# EAGLE schematic Charger Board (EAGLE 6.2)
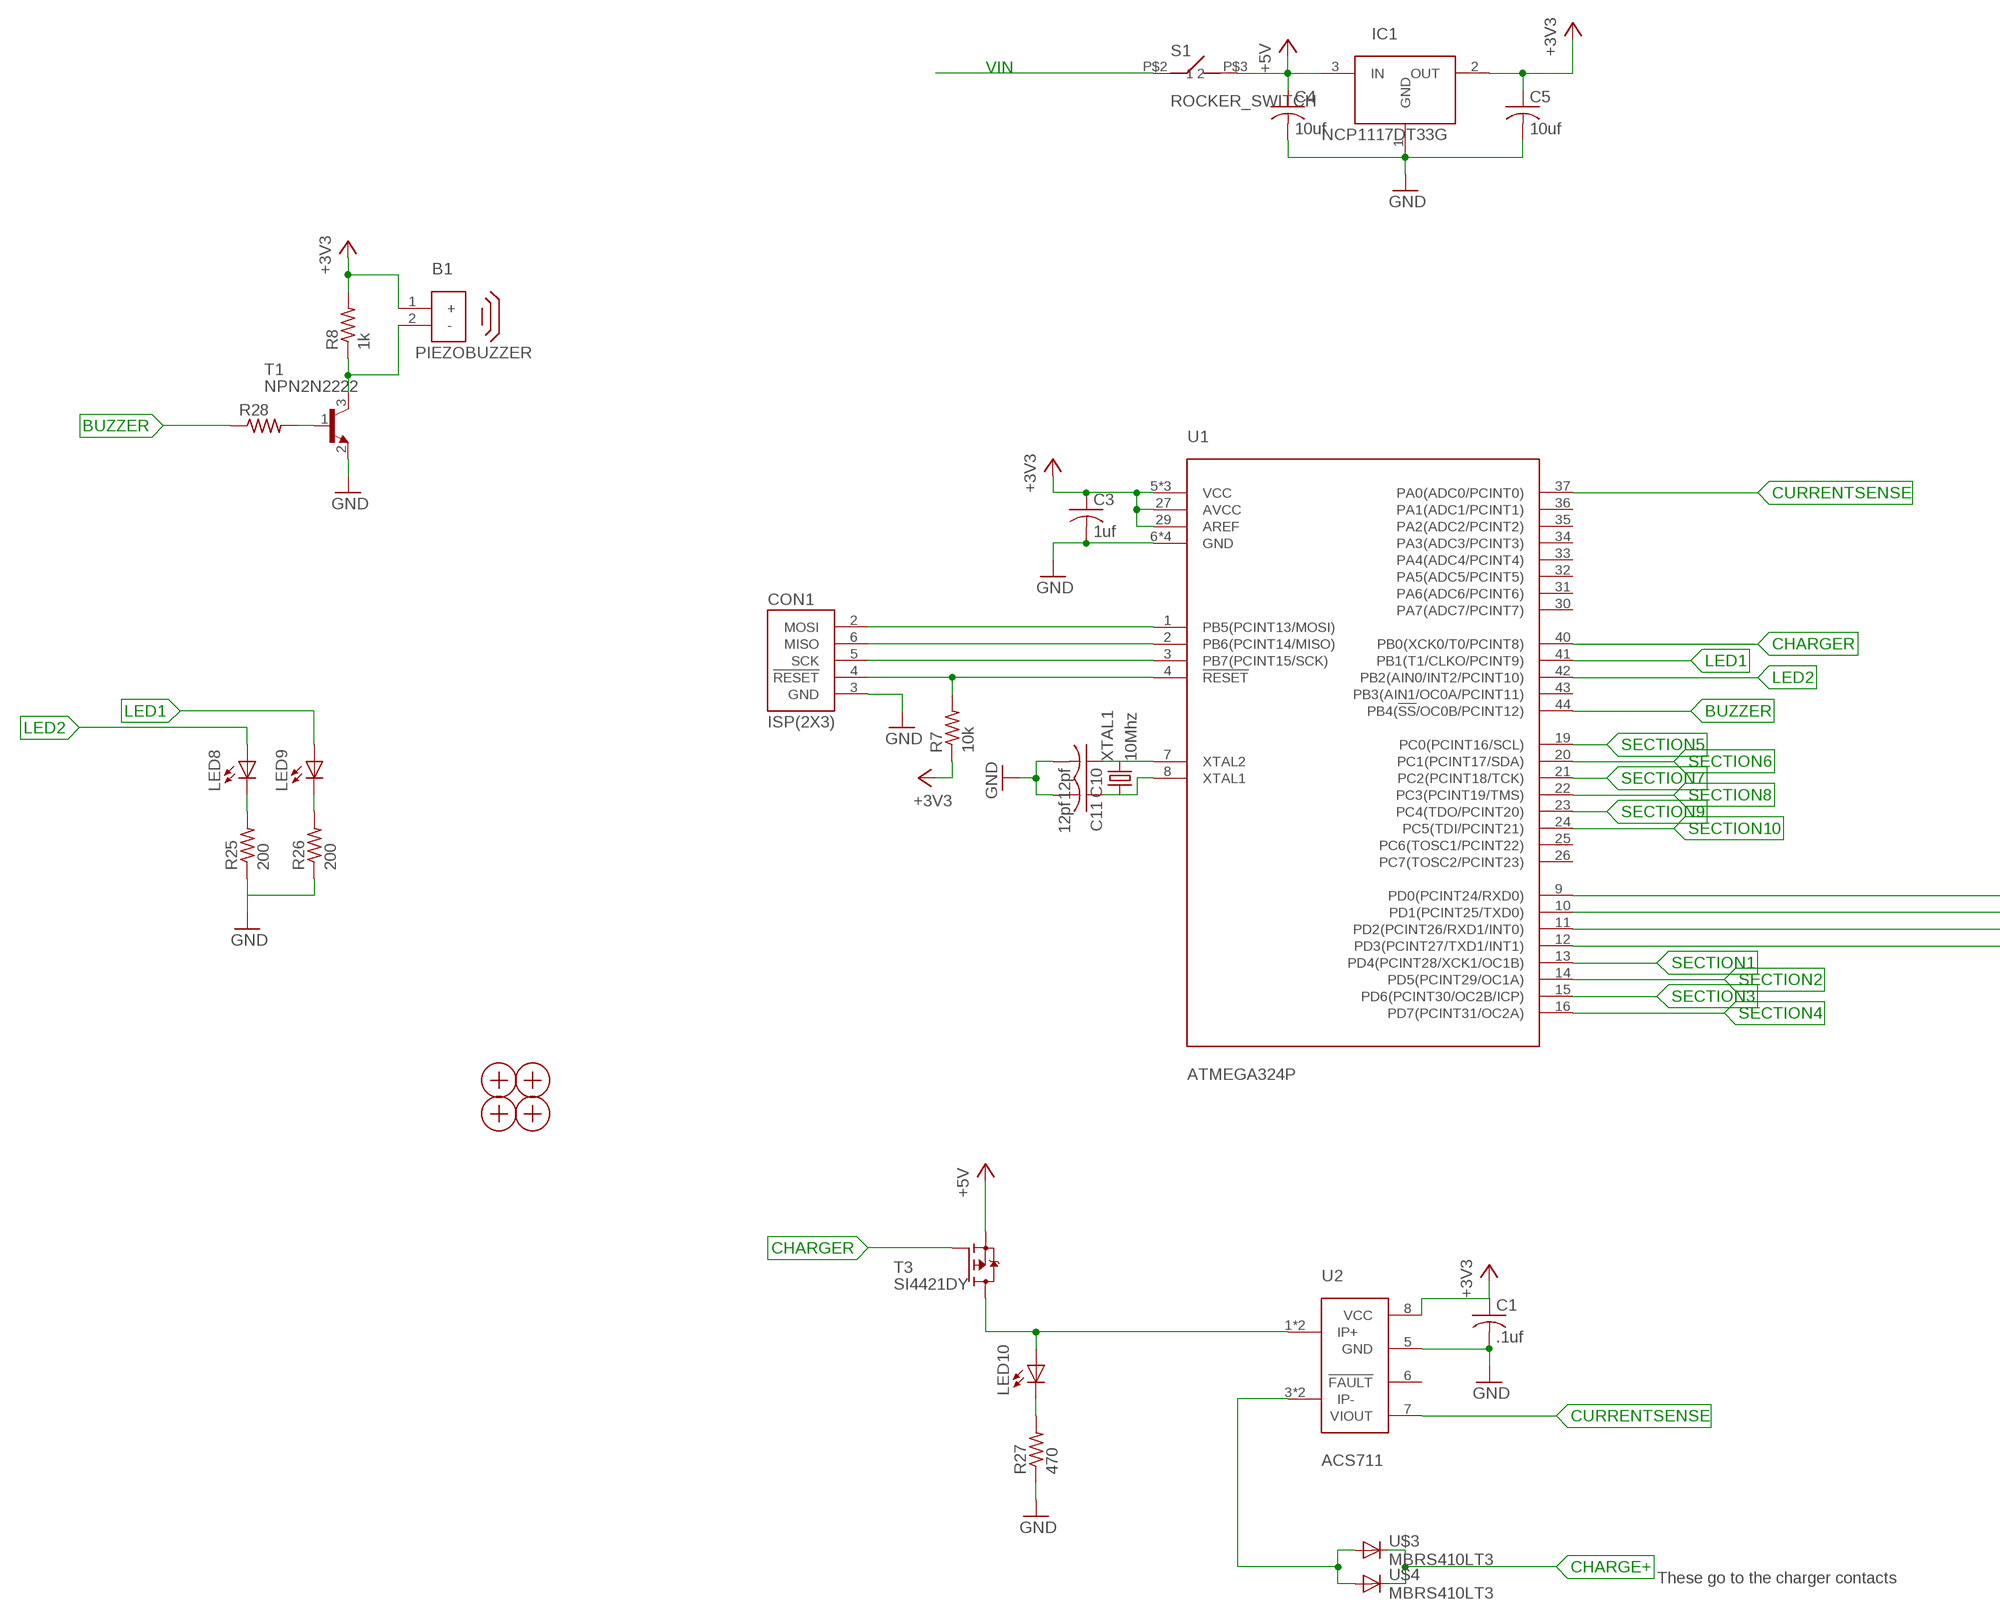
[diagram p0: schematic, sheet 1, part 1 of 2]
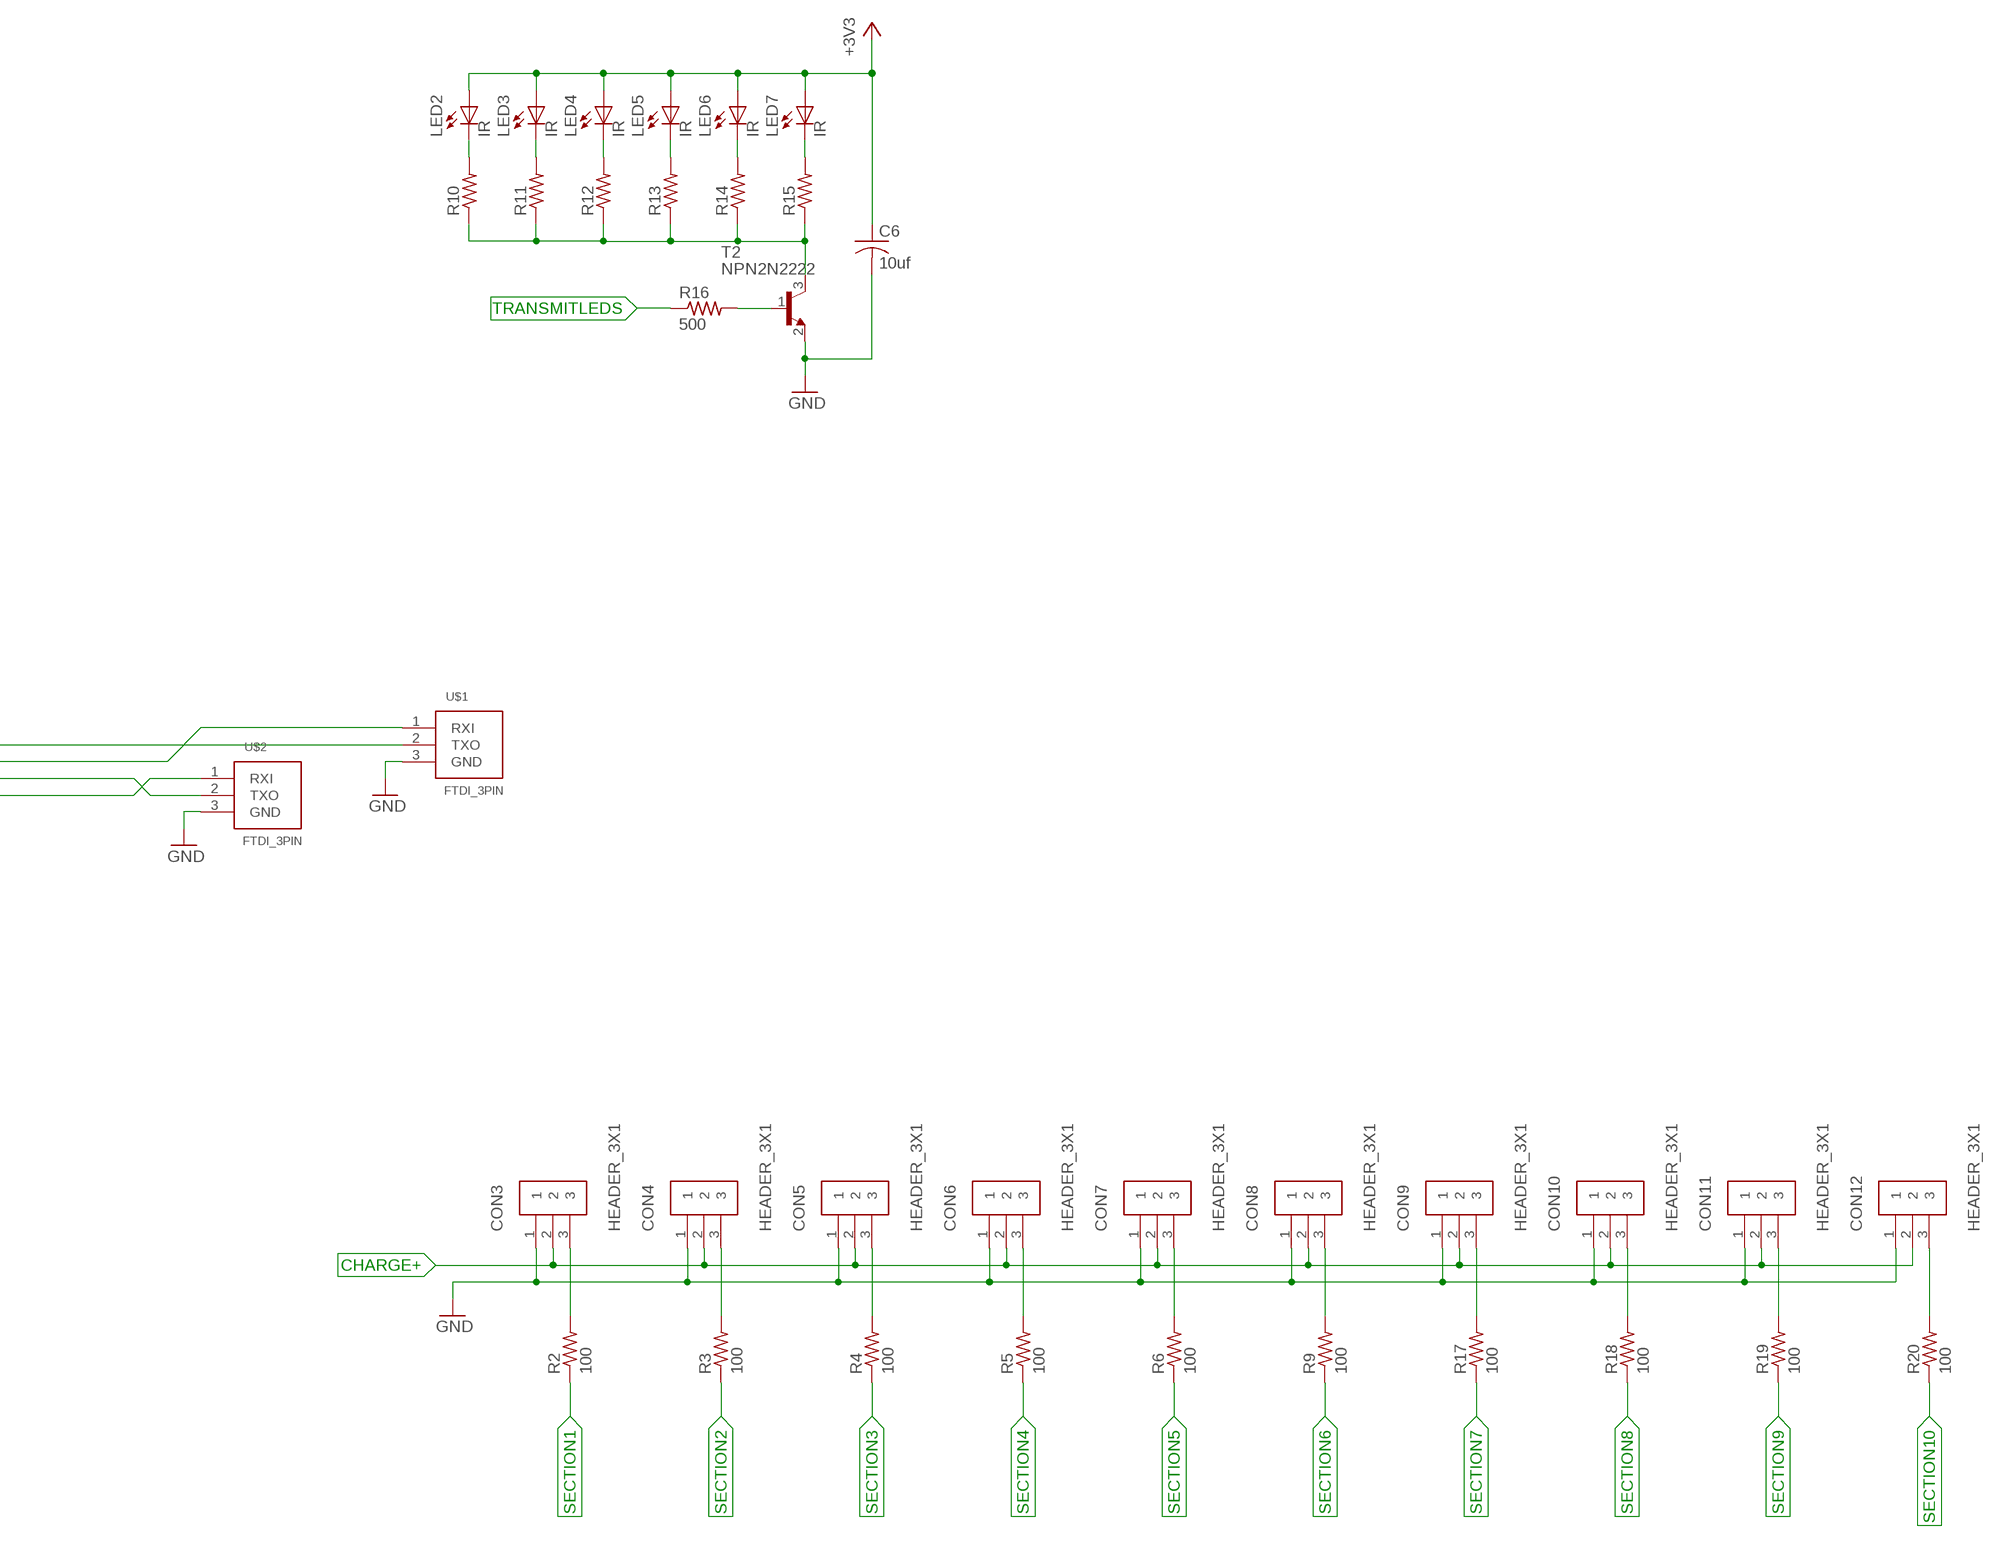
[diagram p1: schematic, sheet 1, part 2 of 2]

## Parts
B1  PIEZOBUZZER  [PIEZOBUZZER]
C1  .1uf  CAP0603  [0603]
C3  1uf  CAP0603  [0603]
C4  10uf  CAP0805  [0805]
C5  10uf  CAP0805  [0805]
C6  10uf  CAP0805  [0805]
C10  12pf  CAP0603  [0603]
C11  12pf  CAP0603  [0603]
CON1  ISP(2X3)  [PINHEADER(2X3)]
CON3  HEADER_3X1  [3PINHEADER_.100"]
CON4  HEADER_3X1  [3PINHEADER_.100"]
CON5  HEADER_3X1  [3PINHEADER_.100"]
CON6  HEADER_3X1  [3PINHEADER_.100"]
CON7  HEADER_3X1  [3PINHEADER_.100"]
CON8  HEADER_3X1  [3PINHEADER_.100"]
CON9  HEADER_3X1  [3PINHEADER_.100"]
CON10  HEADER_3X1  [3PINHEADER_.100"]
CON11  HEADER_3X1  [3PINHEADER_.100"]
CON12  HEADER_3X1  [3PINHEADER_.100"]
H1  MOUNTINGHOLE  [MOUNTINGHOLE]
H2  MOUNTINGHOLE  [MOUNTINGHOLE]
H3  MOUNTINGHOLE  [MOUNTINGHOLE]
H4  MOUNTINGHOLE  [MOUNTINGHOLE]
IC1  NCP1117DT33G  [DPAK]
LED2  IR  LED5MMRA  [5MM_LED_RA]
LED3  IR  LED5MMRA  [5MM_LED_RA]
LED4  IR  LED5MMRA  [5MM_LED_RA]
LED5  IR  LED5MMRA  [5MM_LED_RA]
LED6  IR  LED5MMRA  [5MM_LED_RA]
LED7  IR  LED5MMRA  [5MM_LED_RA]
LED8  LED0603  [0603]
LED9  LED0603  [0603]
LED10  LED0603  [0603]
R2  100  RES0603  [0603]
R3  100  RES0603  [0603]
R4  100  RES0603  [0603]
R5  100  RES0603  [0603]
R6  100  RES0603  [0603]
R7  10k  RES0603  [0603]
R8  1k  RES0603  [0603]
R9  100  RES0603  [0603]
R10  RES0603  [0603]
R11  RES0603  [0603]
R12  RES0603  [0603]
R13  RES0603  [0603]
R14  RES0603  [0603]
R15  RES0603  [0603]
R16  500  RES0603  [0603]
R17  100  RES0603  [0603]
R18  100  RES0603  [0603]
R19  100  RES0603  [0603]
R20  100  RES0603  [0603]
R25  200  RES0603  [0603]
R26  200  RES0603  [0603]
R27  470  RES0603  [0603]
R28  RES0603  [0603]
S1  ROCKER_SWITCH  [DUMMY]
T1  NPN2N2222  [SOT23]
T2  NPN2N2222  [SOT23]
T3  SI4421DY  [S0-8]
U1  ATMEGA324P  [TQFP44]
U2  ACS711  [8SOIC]
U$1  FTDI_3PIN  [3PINHEADER_.100"]
U$2  FTDI_3PIN  [3PINHEADER_.100"]
U$3  MBRS410LT3  [SMD_DIODE]
U$4  MBRS410LT3  [SMD_DIODE]
XTAL1  10Mhz  NX5032GA-10.000000MHZ  [SMDXTAL]

## Nets
+3V3: B1.1(+) C1.1 C3.1 C5.1 C6.1 IC1.2(OUT) LED2.1(A) LED3.1(A) LED4.1(A) LED5.1(A) LED6.1(A) LED7.1(A) R7.1 R8.2 U1.5(VCC) U1.17(VCC) U1.27(AVCC) U1.29(AREF) U1.38(VCC) U2.8(VCC)
+5V: C4.1 IC1.3(IN) S1.P$3 T3.1(S) T3.2(S) T3.3(S)
BUZZER: R28.1 U1.44(PB4(!SS!/OC0B/PCINT12))
CHARGE+: CON3.2 CON4.2 CON5.2 CON6.2 CON7.2 CON8.2 CON9.2 CON10.2 CON11.2 CON12.2 U$3.2(C) U$4.2(C)
CHARGER: T3.4(G) U1.40(PB0(XCK0/T0/PCINT8))
CURRENTSENSE: U1.37(PA0(ADC0/PCINT0)) U2.7(VIOUT)
GND: C1.2 C3.2 C4.2 C5.2 C6.2 C10.2 C11.2 CON1.3(GND) CON3.1 CON4.1 CON5.1 CON6.1 CON7.1 CON8.1 CON9.1 CON10.1 CON11.1 CON12.1 IC1.1(GND) R25.1 R26.1 R27.1 T1.2(E) T2.2(E) U1.6(GND) U1.18(GND) U1.28(GND) U1.39(GND) U2.5(GND) U$1.3(GND) U$2.3(GND)
LED1: LED9.2(A) U1.41(PB1(T1/CLKO/PCINT9))
LED2: LED8.2(A) U1.42(PB2(AIN0/INT2/PCINT10))
N$1: LED10.2(A) T3.5(D) T3.6(D) T3.7(D) T3.8(D) U2.1(IP+) U2.2(IP+)
N$2: CON1.2(MOSI) U1.1(PB5(PCINT13/MOSI))
N$3: CON1.6(MISO) U1.2(PB6(PCINT14/MISO))
N$4: U1.11(PD2(PCINT26/RXD1/INT0)) U$2.2(TXO)
N$5: CON1.5(SCK) U1.3(PB7(PCINT15/SCK))
N$6: CON1.4(!RESET) R7.2 U1.4(!RESET)
N$7: U1.10(PD1(PCINT25/TXD0)) U$1.1(RXI)
N$8: U1.9(PD0(PCINT24/RXD0)) U$1.2(TXO)
N$9: B1.2(-) R8.1 T1.3(C)
N$10: R10.1 R11.1 R12.1 R13.1 R14.1 R15.1 T2.3(C)
N$11: R16.2 T2.1(B)
N$12: C10.1 U1.7(XTAL2) XTAL1.2
N$13: LED2.2(C) R10.2
N$14: LED3.2(C) R11.2
N$15: LED4.2(C) R12.2
N$16: LED5.2(C) R13.2
N$17: LED6.2(C) R14.2
N$18: LED7.2(C) R15.2
N$19: U1.12(PD3(PCINT27/TXD1/INT1)) U$2.1(RXI)
N$20: LED8.1(C) R25.2
N$21: LED9.1(C) R26.2
N$22: LED10.1(C) R27.2
N$23: U2.3(IP-) U2.4(IP-) U$3.1(A) U$4.1(A)
N$24: CON3.3 R2.2
N$25: C11.1 U1.8(XTAL1) XTAL1.1
N$26: R28.2 T1.1(B)
N$27: CON4.3 R3.2
N$28: CON5.3 R4.2
N$29: CON6.3 R5.2
N$30: CON7.3 R6.2
N$31: CON8.3 R9.2
N$32: CON9.3 R17.2
N$33: CON10.3 R18.2
N$34: CON11.3 R19.2
N$35: CON12.3 R20.2
SECTION1: R2.1 U1.13(PD4(PCINT28/XCK1/OC1B))
SECTION2: R3.1 U1.14(PD5(PCINT29/OC1A))
SECTION3: R4.1 U1.15(PD6(PCINT30/OC2B/ICP))
SECTION4: R5.1 U1.16(PD7(PCINT31/OC2A))
SECTION5: R6.1 U1.19(PC0(PCINT16/SCL))
SECTION6: R9.1 U1.20(PC1(PCINT17/SDA))
SECTION7: R17.1 U1.21(PC2(PCINT18/TCK))
SECTION8: R18.1 U1.22(PC3(PCINT19/TMS))
SECTION9: R19.1 U1.23(PC4(TDO/PCINT20))
SECTION10: R20.1 U1.24(PC5(TDI/PCINT21))
TRANSMITLEDS: R16.1
VIN: S1.P$2
Unconnected: U1.25(PC6(TOSC1/PCINT22)) U1.26(PC7(TOSC2/PCINT23)) U1.30(PA7(ADC7/PCINT7)) U1.31(PA6(ADC6/PCINT6)) U1.32(PA5(ADC5/PCINT5)) U1.33(PA4(ADC4/PCINT4)) U1.34(PA3(ADC3/PCINT3)) U1.35(PA2(ADC2/PCINT2)) U1.36(PA1(ADC1/PCINT1)) U1.43(PB3(AIN1/OC0A/PCINT11)) U2.6(!FAULT)

## Notes on the sheet
- These go to the charger contacts

## Library data of the parts
B1 = Passive:PIEZOBUZZER: Digikey Part Number: 445-2525-1-ND Manufacturer Part Number: PS1240P02BT
C1 C3-C6 C10 C11 = Passive:CAP
CON1 = Mechanical:ISP
CON3-CON12 = Mechanical:HEADER_3X1
H1-H4 = Mechanical:MOUNTINGHOLE
IC1 = PowerIC:NCP1117DT33G: Digikey Part Number: NCP1117DT33GOS-ND Manufacturer Part Number: NCP1117DT33G
LED2-LED10 = Passive:LED
R2-R20 R25-R28 = Passive:RES
S1 = Mechanical:ROCKER_SWITCH
T1 T2 = Passive:NPN2N2222: Digikey Part Number: 568-1738-1-ND Manufacturer Part Number: PMBT2222A,215
T3 = Passive:SI4421DY: Digikey Part Number: SI4421DY-T1-E3CT-ND Manufacturer Part Number: SI4421DY-T1-E3
U1 = DigitalIC:ATMEGA324P: Digikey Part Number: ATMEGA324P-20AU-ND Manufacturer Part Number: ATMEGA324P-20AU
U2 = PowerIC:ACS711
U$1 U$2 = Mechanical:FTDI_3PIN
U$3 U$4 = Passive:MBRS410LT3: Digikey Part Number: MBRS410LT3GOSCT-ND Manufacturer Part Number: MBRS410LT3G
XTAL1 = Passive:NX5032GA-10.000000MHZ: Digikey Part Number: 644-1033-1-ND Manufacturer Part Number: NX5032GA-10.000000MHZ-LN-CD-1